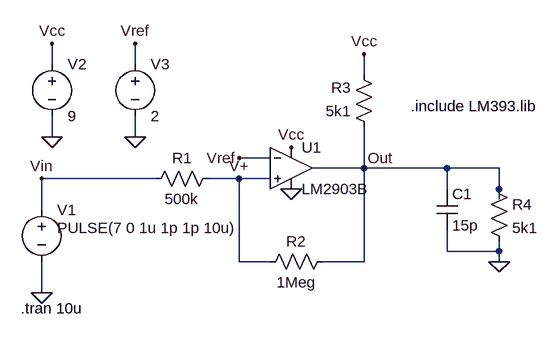
[diagram p0: schematic Comparador-Tiempo de propagacion.asc]
Comparador-Tiempo de propagacion.asc, the LTspice schematic file:
Version 4
SHEET 1 880 680
WIRE -256 16 -256 -16
WIRE -128 16 -128 -16
WIRE 224 32 224 0
WIRE -256 128 -256 96
WIRE -128 128 -128 96
WIRE 80 160 32 160
WIRE 224 176 224 112
WIRE 224 176 144 176
WIRE 352 176 224 176
WIRE 432 176 352 176
WIRE -96 192 -272 192
WIRE 32 192 -16 192
WIRE 80 192 32 192
WIRE 352 208 352 176
WIRE 432 208 432 176
WIRE 432 224 432 208
WIRE -272 240 -272 192
WIRE 352 304 352 272
WIRE 432 304 432 288
WIRE 432 304 352 304
WIRE 32 320 32 192
WIRE 80 320 32 320
WIRE 224 320 224 176
WIRE 224 320 160 320
WIRE 432 320 432 304
WIRE -272 368 -272 320
FLAG -256 128 0
FLAG -256 -16 Vcc
FLAG 112 144 Vcc
FLAG 112 208 0
FLAG -272 368 0
FLAG 224 0 Vcc
FLAG -128 128 0
FLAG -128 -16 Vref
FLAG 32 160 Vref
FLAG 224 176 Out
FLAG -272 192 Vin
FLAG 432 320 0
FLAG 32 192 V+
SYMBOL Comparators\\LT1018 112 176 R0
SYMATTR InstName U1
SYMATTR Value LM2903B
SYMBOL res 0 176 R90
WINDOW 0 0 56 VBottom 2
WINDOW 3 32 56 VTop 2
SYMATTR InstName R1
SYMATTR Value 500k
SYMBOL res 176 304 R90
WINDOW 0 0 56 VBottom 2
WINDOW 3 32 56 VTop 2
SYMATTR InstName R2
SYMATTR Value 1Meg
SYMBOL res 240 128 R180
WINDOW 0 36 76 Left 2
WINDOW 3 36 40 Left 2
SYMATTR InstName R3
SYMATTR Value 5k1
SYMBOL voltage -272 224 R0
WINDOW 123 0 0 Left 0
WINDOW 39 0 0 Left 0
WINDOW 3 24 44 Left 2
SYMATTR Value PULSE(7 0 1u 1p 1p 10u)
SYMATTR InstName V1
SYMBOL voltage -256 0 R0
WINDOW 123 0 0 Left 0
WINDOW 39 0 0 Left 0
SYMATTR InstName V2
SYMATTR Value 9
SYMBOL voltage -128 0 R0
WINDOW 123 0 0 Left 0
WINDOW 39 0 0 Left 0
SYMATTR InstName V3
SYMATTR Value 2
SYMBOL cap 336 208 R0
SYMATTR InstName C1
SYMATTR Value 15p
SYMBOL res 416 192 R0
SYMATTR InstName R4
SYMATTR Value 5k1
TEXT 296 80 Left 2 !.include LM393.lib
TEXT -304 392 Left 2 !.tran 10u

The netlist it stands for:
* Comparador-Tiempo de propagacion.asc
XU1 V+ Vref Vcc 0 Out LT1018  ; LM2903B, pins In+ In- V+ V- OUT
R1 V+ Vin 500k
R2 Out V+ 1Meg
R3 Out Vcc 5k1
V1 Vin 0 PULSE(7 0 1u 1p 1p 10u)
V2 Vcc 0 9
V3 Vref 0 2
C1 Out 0 15p
R4 Out 0 5k1
.include LM393.lib
.tran 10u
.lib LTC1.lib
.backanno
.end